# Altium schematic sheet Power.SchDoc
size A3; DocumentNumber: 3; SheetNumber: 3; SheetTotal: 18
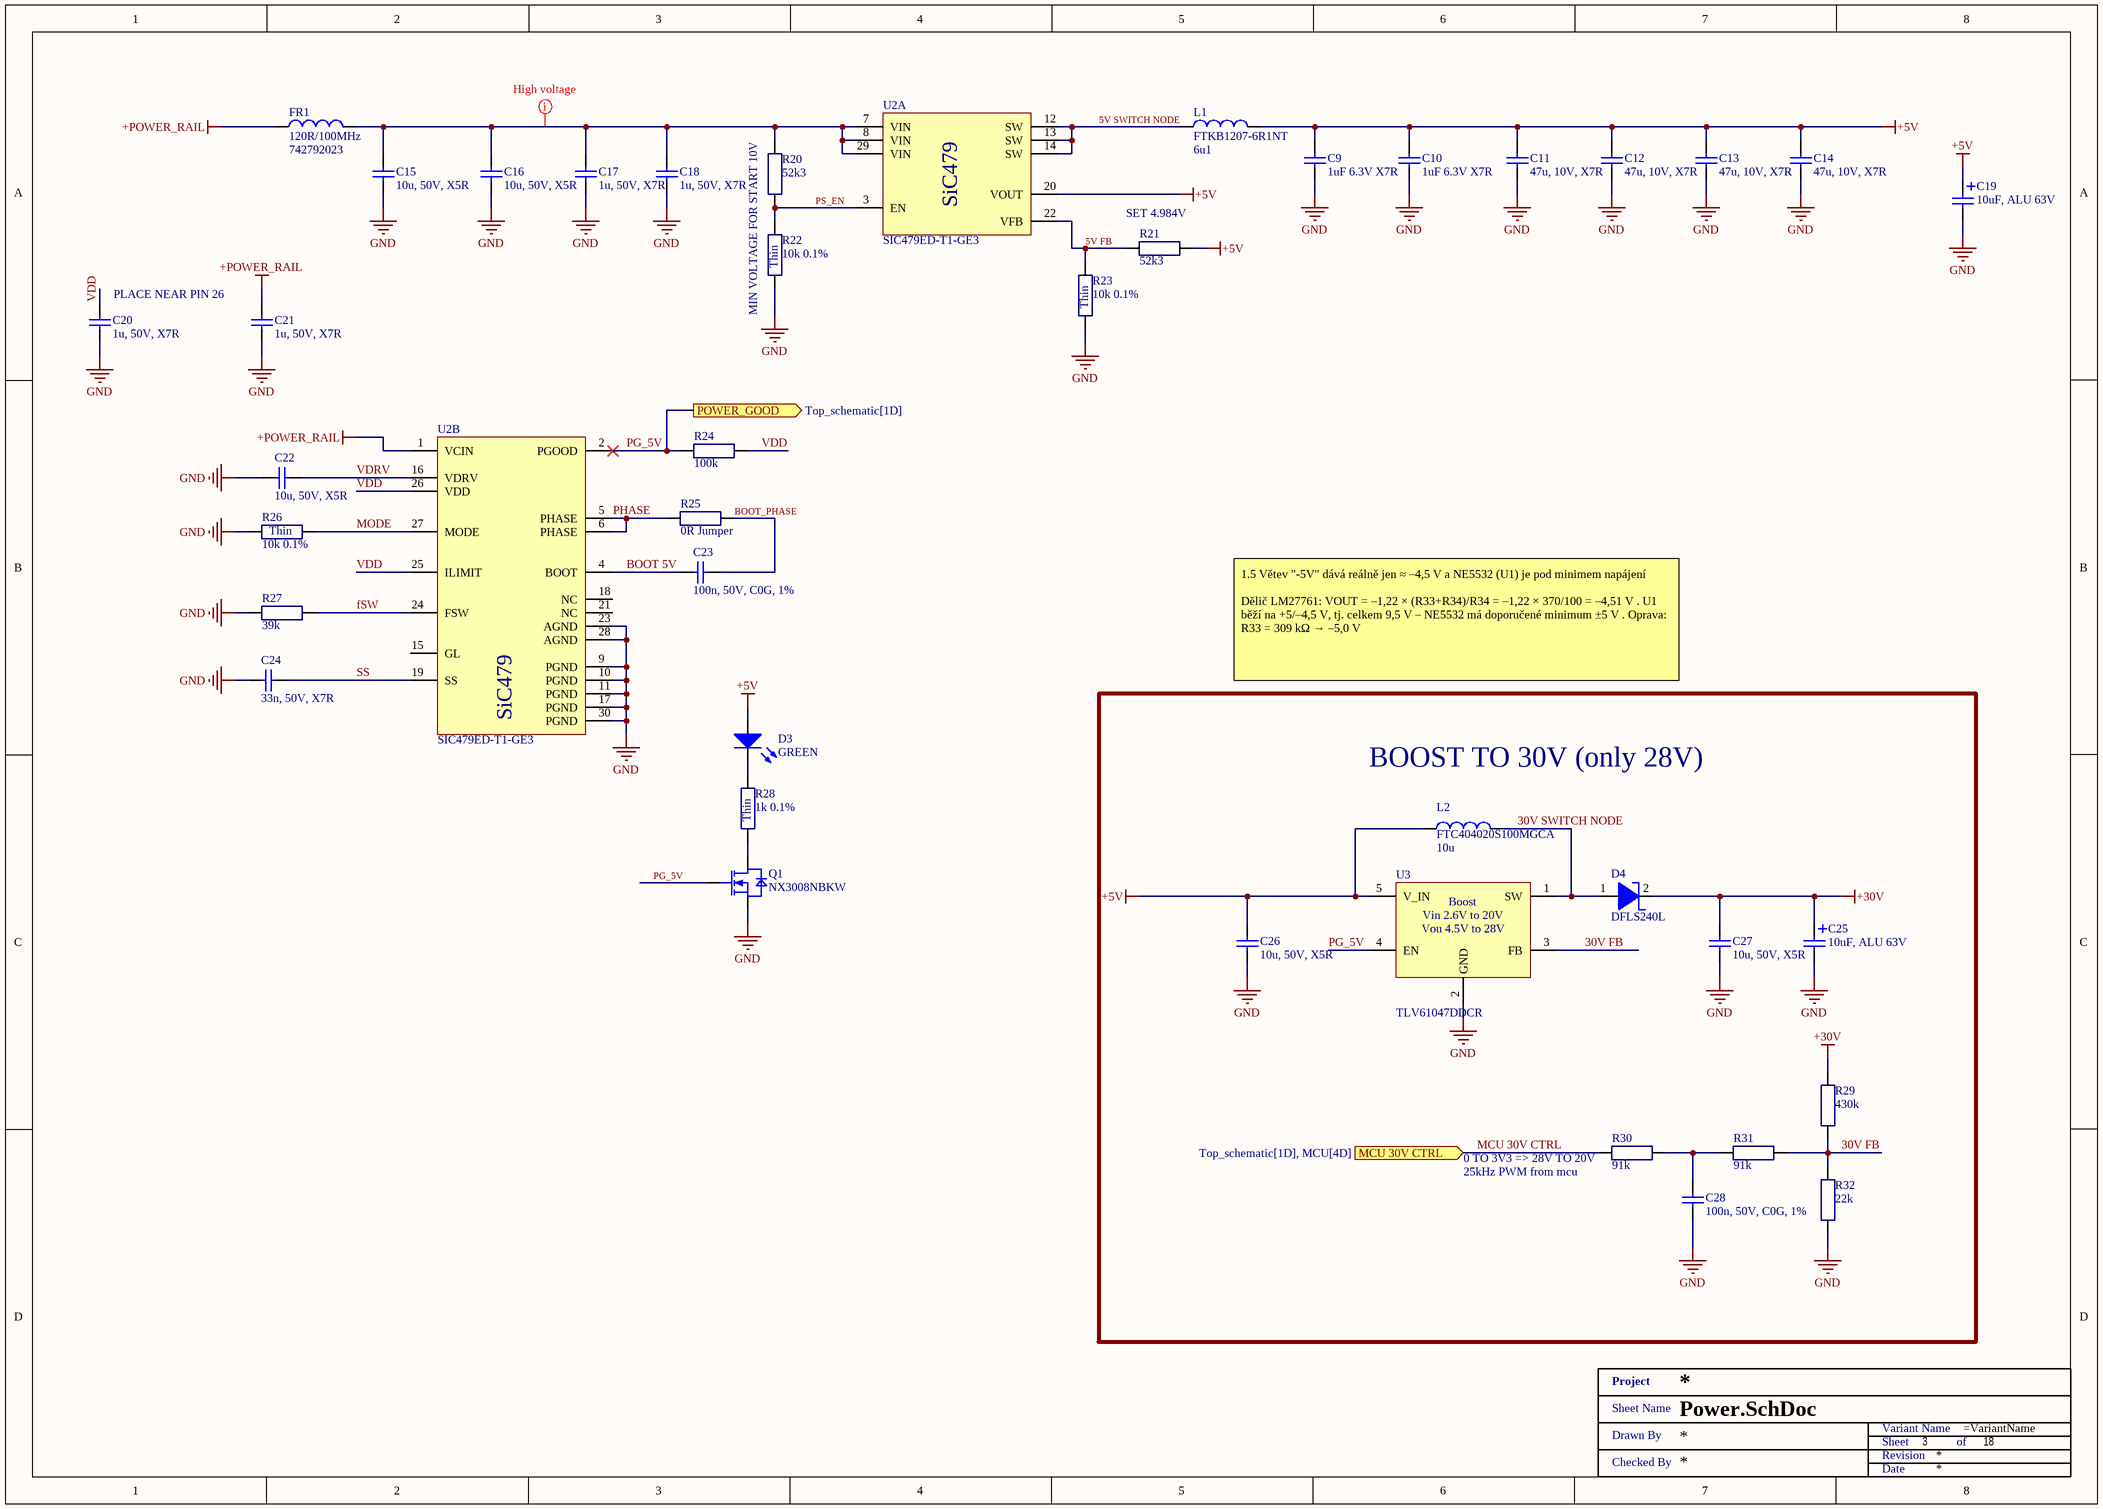
[diagram p0: Power.SchDoc]

## Parts
C9  1uF 6.3V X7R  [SMD0402]
C10  1uF 6.3V X7R  [SMD0402]
C11  47u, 10V, X7R  [SMD1210]
C12  47u, 10V, X7R  [SMD1210]
C13  47u, 10V, X7R  [SMD1210]
C14  47u, 10V, X7R  [SMD1210]
C15  10u, 50V, X5R  [SMD1206]
C16  10u, 50V, X5R  [SMD1206]
C17  1u, 50V, X7R  [SMD0603]
C18  1u, 50V, X7R  [SMD0603]
C19  10uF, ALU 63V  [WCAP-ATLI_5x11x2]
C20  1u, 50V, X7R  [SMD0603]
C21  1u, 50V, X7R  [SMD0603]
C22  10u, 50V, X5R  [SMD1206]
C23  100n, 50V, C0G, 1%  [SMD1206]
C24  33n, 50V, X7R  [SMD0603]
C25  10uF, ALU 63V  [WCAP-ATLI_5x11x2]
C26  10u, 50V, X5R  [SMD1206]
C27  10u, 50V, X5R  [SMD1206]
C28  100n, 50V, C0G, 1%  [SMD1206]
D3  GREEN  [MCL-S270]
D4  DFLS240L  [PowerDI 123]
FR1  120R/100MHz  [SMD0805 - R]
L1  FTKB1207-6R1NT  Inductance: 6u1  [FTKB1207]
L2  FTC404020S100MGCA  Inductance: 10u  [FTC404020S]
Q1  NX3008NBKW  [SOT323]
R20  52k3  [SMD0402 - R]
R21  52k3  [SMD0402 - R]
R22  10k 0.1%  [SMD0402 - R]
R23  10k 0.1%  [SMD0402 - R]
R24  100k  [SMD0402 - R]
R25  0R Jumper  [SMD0402 - R]
R26  10k 0.1%  [SMD0402 - R]
R27  39k  [SMD0402 - R]
R28  1k 0.1%  [SMD0402 - R]
R29  430k  [SMD0402 - R]
R30  91k  [SMD0402 - R]
R31  91k  [SMD0402 - R]
R32  22k  [SMD0402 - R]
U2  SIC479ED-T1-GE3  [POWERPAK_MLP55-27L_VIS]  (parts A,B of 2)
U3  TLV61047DDCR  [SOT23-5]
XX?  Title 1  (value not drawn)  (graphical)

## Blocks framed on the sheet
BOOST TO 30V (only 28V): C25-C28 D4 L2 R29-R32 U3

## Ports
MCU 30V CTRL (in, see Top_schematic[1D], MCU[4D]), POWER_GOOD (out, see Top_schematic[1D])

## Nets
+5V: C9.2 C10.2 C11.2 C12.2 C13.2 C14.2 C19.1 C26.2 D3.1(A) L1.2 L2.1 R21.2 U2.20(VOUT) U3.5(V_IN)
+30V: C25.1 C27.2 D4.2(C) R29.2
+POWER_RAIL: C21.2 FR1.1 U2.1(VCIN)
GND: C9.1 C10.1 C11.1 C12.1 C13.1 C14.1 C15.1 C16.1 C17.1 C18.1 C19.2 C20.1 C21.1 C22.2 C24.1 C25.2 C26.1 C27.1 C28.1 Q1.2(S) R22.1 R23.1 R26.1 R27.1 R32.1 U2.9(PGND) U2.10(PGND) U2.11(PGND) U2.17(PGND) U2.23(AGND) U2.28(AGND) U2.30(PGND) U3.2(GND)
5V FB: R21.1 R23.2 U2.22(VFB)
5V SWITCH NODE: L1.1 U2.12(SW) U2.13(SW) U2.14(SW)
30V FB: R29.1 R31.2 R32.2 U3.3(FB)
30V SWITCH NODE: D4.1(A) L2.2 U3.1(SW)
BOOT 5V: C23.1 U2.4(BOOT)
BOOT_PHASE: C23.2 R25.2
fSW: R27.2 U2.24(FSW)
MCU 30V CTRL: R30.1 ; port MCU 30V CTRL
MODE: R26.2 U2.27(MODE)
PG_5V: Q1.1(G) R24.1 U2.2(PGOOD) U3.4(EN) ; port POWER_GOOD
PHASE: R25.1 U2.5(PHASE) U2.6(PHASE)
PS_EN: R20.1 R22.2 U2.3(EN)
SS: C24.2 U2.19(SS)
VDD: C20.2 R24.2 U2.25(ILIMIT) U2.26(VDD)
VDRV: C22.1 U2.16(VDRV)
NetC15_2: C15.2 C16.2 C17.2 C18.2 FR1.2 R20.2 U2.7(VIN) U2.8(VIN) U2.29(VIN)
NetC28_2: C28.2 R30.2 R31.1
NetD3_2: D3.2(K) R28.2
NetQ1_3: Q1.3(D) R28.1

Not connected (* = marked no-connect by the designer): U2 15(GL) 18(NC) 21(NC)

## Layout directives
net class HV: NetC15_2

## Notes on the sheet
- (near R21) SET 4.984V
- (near C20) PLACE NEAR PIN 26
- MIN VOLTAGE FOR START 10V
- 1.5 Větev "-5V" dává reálně jen ≈ –4,5 V a NE5532 (U1) je pod minimem napájení
  Dělič LM27761: VOUT = –1,22 × (R33+R34)/R34 = –1,22 × 370/100 = –4,51 V . U1 běží na +5/–4,5 V, tj. celkem 9,5 V – NE5532 má doporučené minimum ±5 V . Oprava: R33 = 309 kΩ → –5,0 V
- (near R30) 0 TO 3V3 => 28V TO 20V
- (near R30) 25kHz PWM from mcu
- (in symbol SIC479ED-T1-GE3, part A) SiC479
- (in symbol SIC479ED-T1-GE3, part B) SiC479
- (in symbol TC0225B1001TCC) Thin
- (in symbol TC0225B1002TCC) Thin
- (in symbol Title 1) Project; Sheet Name; Variant Name; Drawn By; Sheet; of; Revision; Checked By; Date
- (in symbol TLV61047DDCR) Vin 2.6V to 20V; Vou 4.5V to 28V

## Library data of the parts
C9 C10 = TCC0402X7R105K6R3AT: Capacitor: MLCC; SMD; 0402; 1µF; 6.3V; ±10%; X7R; CCTC; Capacitance: 1u; Supplier 1: LCSC; Supplier Part Number 1: C5448871; Manufacturer: CCTC; Manufacturer Part Number: TCC0402X7R105K6R3AT; Category: Ceramic Capacitors; Stock 1: 242350; Pricing 1: 50=0.0089, 500=0.0072, 1500=0.0063, 10000=0.0058, 20000=0.0053, 50000=0.005 (USD); ComponentLink1URL: https://datasheet.octopart.com:443/TCC0402X7R105K6R3AT-CCTC-datasheet-194166649.pdf?src-supplier=LCSC; ComponentLink1Description: https://datasheet.octopart.com:443/TCC0402X7R105K6R3AT-CCTC-datasheet-194166649.pdf?src-supplier=LCSC; ComponentLink2URL: https://datasheet.octopart.com:443/TCC0402X7R105K6R3AT-CCTC-datasheet-192317456.pdf?src-supplier=HQonline; ComponentLink2Description: https://datasheet.octopart.com:443/TCC0402X7R105K6R3AT-CCTC-datasheet-192317456.pdf?src-supplier=HQonline
C11-C14 = CL32B476MPJNNNE: Cap Ceramic 47uF 10V X7R 20% Pad SMD 1210 125C T/R; Manufacturer: Samsung; Supplier 1: Mouser; Supplier Part Number 1: 187-CL32B476MPJNNNE; Manufacturer Part Number: CL32B476MPJNNNE; RoHS: Yes; Category: Ceramic Capacitors; Stock 1: 61232; Pricing 1: 1=0.51, 10=0.377, 50=0.377, 100=0.263, 1000=0.198, 10000=0.163 (USD); Case/Package: 1210; Dielectric: X7R; Voltage Rating (DC): 10V; Tolerance: 20%; Value: 47uF; RoHS Compliant: Yes; ComponentLink1URL: http://www.samsungsem.com/kr/support/library/product-catalog/__icsFiles/afieldfile/2014/11/13/MLCC.pdf?src-supplier=Avnet; ComponentLink1Description: http://www.samsungsem.com/kr/support/library/product-catalog/__icsFiles/afieldfile/2014/11/13/MLCC.pdf?src-supplier=Avnet; Supplier 2: Arrow Electronics; Supplier Part Number 2: CL32B476MPJNNNE
C15 C16 C22 C26 C27 = UMK316BBJ106KL-T: CAP CER 10UF 50V X5R 1206; Manufacturer: Taiyo Yuden; Tolerance: 10%; Supplier 1: Mouser; Supplier Part Number 1: 963-UMK316BBJ106KL-T; Manufacturer Part Number: UMK316BBJ106KL-T; RoHS: Yes; Category: Ceramic Capacitors; Stock 1: 207945; Pricing 1: 1=0,42000, 10=0,18000, 100=0,12800, 500=0,11000, 1000=0,09700, 2000=0,08000 (USD); Mount: Surface Mount; Case/Package: 1206; Min Operating Temperature: -55°C; Max Operating Temperature: 85°C; Packaging: Tape and Reel; Capacitance: 10u; Voltage Rating: 50V; Length: 0.126inch; Width: 0.063inch; Thickness: 0.071inch; Lead Free: Lead Free; ComponentLink1URL: http://ds.yuden.co.jp/TYCOMPAS/ut/detail.do?productNo=UMK316BBJ106KL-T&fileName=UMK316BBJ106KL-T_SS&mode=specSheetDownload&src-supplier=Digi-Key; ComponentLink1Description: http://ds.yuden.co.jp/TYCOMPAS/ut/detail.do?productNo=UMK316BBJ106KL-T&fileName=UMK316BBJ106KL-T_SS&mode=specSheetDownload&src-supplier=Digi-Key; ComponentLink2URL: https://www.yuden.co.jp/productdata/catalog/mlcc01_e.pdf?src-supplier=Digi-Key; ComponentLink2Description: https://www.yuden.co.jp/productdata/catalog/mlcc01_e.pdf?src-supplier=Digi-Key; ComponentLink3URL: http://www.yuden.co.jp/productdata/catalog/en/mlcc_all_e.pdf?src-supplier=Digi-Key; ComponentLink3Description: http://www.yuden.co.jp/productdata/catalog/en/mlcc_all_e.pdf?src-supplier=Digi-Key; Supplier 2: Digi-Key; Supplier Part Number 2: 587-5960-1-ND; Supplier 3: Avnet; Supplier Part Number 3: UMK316BBJ106KL-T
C17 C18 C20 C21 = UMK107AB7105KA-T: 0603 1 uF 50 V ±10% Tolerance X7R SMT Multilayer Ceramic Capacitor; Manufacturer: Taiyo Yuden; Supplier 1: Mouser; Supplier Part Number 1: 963-UMK107AB7105KA-T; Manufacturer Part Number: UMK107AB7105KA-T; RoHS: Yes; Category: Ceramic Capacitors; Stock 1: 419967; Pricing 1: 1=0,39000, 10=0,13500, 100=0,09200, 500=0,07800, 1000=0,06100, 4000=0,06100 (USD); Mount: Surface Mount; Case/Package: 0603; Case Code (Metric): 1608; Case Code (Imperial): 0603; Min Operating Temperature: -55°C; Max Operating Temperature: 125°C; Tolerance: 10%; Capacitance: 1u; Packaging: Tape and Reel; Package Quantity: 1; Voltage Rating: 50V; Voltage Rating (DC): 50V; Dielectric: X7R; Termination: SMD/SMT; Length: 1.6mm; Height: 0.8mm; Width: 0.031inch; Thickness: 0.037inch; Depth: 0.8mm; Radiation Hardening: No; Halogen Free: Halogen Free; ComponentLink1URL: https://datasheet.ciiva.com/15922/umk107ab7105ka-t-pdf-15922601.pdf?src-supplier=Onlinecomponents.com; ComponentLink1Description: https://datasheet.ciiva.com/15922/umk107ab7105ka-t-pdf-15922601.pdf?src-supplier=Onlinecomponents.com; ComponentLink2URL: https://datasheet.ciiva.com/6257/umk107ab7105ka-t-ss-6257600.pdf?src-supplier=Digi-Key; ComponentLink2Description: https://datasheet.ciiva.com/6257/umk107ab7105ka-t-ss-6257600.pdf?src-supplier=Digi-Key; ComponentLink3URL: https://datasheet.ciiva.com/30137/76umk107ab7105ka-t-30137806.pdf?src-supplier=Onlinecomponents.com; ComponentLink3Description: https://datasheet.ciiva.com/30137/76umk107ab7105ka-t-30137806.pdf?src-supplier=Onlinecomponents.com; Supplier 2: Farnell; Supplier Part Number 2: 2779113; Supplier 3: Digi-Key; Supplier Part Number 3: 587-3247-6-ND
C19 C25 = 860080772001: WURTH ELEKTRONIK - 860080772001 - CAP, ALU ELEC, 10UF, 63V, RADIAL; Ripple Current: 135mA @ 100kHz; Capacitance: 10u; Manufacturer: WURTH ELEKTRONIK; Manufacturer Part Number: 860080772001; RoHS: YES; Stock 1: 553; Pricing 1: 1=0.0957, 3=0.091, 5=0.0863, 10=0.0825, 20=0.0786, 50=0.0692, 250=0.0647, 500=0.0564 (GBP); ComponentLink1URL: http://www.farnell.com/datasheets/1879798.pdf; ComponentLink1Description: http://www.farnell.com/datasheets/1879798.pdf; Voltage Rating: 63V; Stock 3: 2136; Pricing 3: 1=0.62, 50=0.335, 100=0.289, 250=0.259, 500=0.235, 1500=0.202, 7500=0.182, 15000=0.178 (GBP); ComponentLink2URL: http://www.farnell.com/datasheets/2065186.pdf; ComponentLink2Description: http://www.farnell.com/datasheets/2065186.pdf; Supplier 1: Mouser; Supplier Part Number 1: 710-860080772001; Supplier 2: Farnell; Supplier Part Number 2: 2465955; Supplier 3: Digi-Key; Supplier Part Number 3: 732-9121-1-ND
C23 C28 = GCM31C5C1H104FA16L: CAP CER 0.1UF 50V C0G/NP0 1206 1%; Manufacturer: Murata; Supplier 1: Mouser; Supplier Part Number 1: 81-GCM31C5C1H104FA16; Manufacturer Part Number: GCM31C5C1H104FA16L; RoHS: No; Stock 1: 9381; Pricing 1: 1=1,24000, 10=0,98200, 25=0,90100, 100=0,73700, 250=0,59000, 500=0,55700 (USD); Supplier 2: Digi-Key; Supplier Part Number 2: 490-GCM31C5C1H104FA16LCT-ND; Supplier 3: Future Electronics; Supplier Part Number 3: GCM31C5C1H104FA16L-CUTT; Capacitance: 100n
C24 = 06035C333JAT2A: 0603 33nF Ceramic Multilayer Capacitor; 50 V dc; +125degC; X7R Dielectric; +/-5%; Manufacturer: Kyocera AVX; Tolerance: 5%; Dissipation Factor: 2.5%; Supplier 1: Mouser; Supplier Part Number 1: 581-06035C333J; Manufacturer Part Number: 06035C333JAT2A; Stock 1: 266948; Pricing 1: 1 = 0.13000, 10 = 0.12100, 50 = 0.12100, 100 = 0.06000, 1000 = 0.03600, 10000 = 0.02400 (USD); RoHS: Yes; Mount: Surface Mount,PCB; Case/Package: 0603; Number of Pins: 2; Case Code (Metric): 1608; Case Code (Imperial): 0603; Contact Plating: Tin,Matte; Dielectric Material: Ceramic; Min Operating Temperature: -55°C; Max Operating Temperature: 125°C; Capacitance: 33n; Dielectric: X7R; Packaging: Tape and Reel; Voltage Rating (DC): 50V; Package Quantity: 1; Voltage Rating: 50V; Termination: SMD/SMT; Voltage: 50V; Length: 1.6mm; Height: 0.9mm; Width: 0.032inch; Depth: 0.81mm; Thickness: 0.035inch; Radiation Hardening: No; REACH SVHC: No SVHC; Lead Free: Lead Free; ComponentLink1URL: https://datasheet.ciiva.com/7855/1679506-7855093.pdf?src-supplier=Element14; ComponentLink1Description: https://datasheet.ciiva.com/7855/1679506-7855093.pdf?src-supplier=Element14; ComponentLink2URL: https://datasheet.ciiva.com/28694/cx7r-28694479.pdf?src-supplier=Element14; ComponentLink2Description: https://datasheet.ciiva.com/28694/cx7r-28694479.pdf?src-supplier=Element14; ComponentLink3URL: https://datasheet.ciiva.com/152/cx7r-152032.pdf?src-supplier=Digi-Key; ComponentLink3Description: https://datasheet.ciiva.com/152/cx7r-152032.pdf?src-supplier=Digi-Key; ComponentLink4URL: https://datasheet.ciiva.com/152/cx7r-152033.pdf?src-supplier=Digi-Key; ComponentLink4Description: https://datasheet.ciiva.com/152/cx7r-152033.pdf?src-supplier=Digi-Key; ComponentLink5URL: https://datasheet.ciiva.com/1457/84526-1457941.pdf?src-supplier=Element14; ComponentLink5Description: https://datasheet.ciiva.com/1457/84526-1457941.pdf?src-supplier=Element14; ComponentLink6URL: https://datasheet.ciiva.com/1457/84526-1457942.pdf?src-supplier=Element14; ComponentLink6Description: https://datasheet.ciiva.com/1457/84526-1457942.pdf?src-supplier=Element14; ComponentLink7URL: https://datasheet.ciiva.com/17084/cx7r-17084518.pdf?src-supplier=Future+Electronics; ComponentLink7Description: https://datasheet.ciiva.com/17084/cx7r-17084518.pdf?src-supplier=Future+Electronics; ComponentLink8URL: https://datasheet.ciiva.com/2987/cx7r-2987848.pdf?src-supplier=Avnet; ComponentLink8Description: https://datasheet.ciiva.com/2987/cx7r-2987848.pdf?src-supplier=Avnet; ComponentLink9URL: https://datasheet.ciiva.com/14605/70001075-14605242.pdf?src-supplier=Allied+Electronics; ComponentLink9Description: https://datasheet.ciiva.com/14605/70001075-14605242.pdf?src-supplier=Allied+Electronics; ComponentLink10URL: https://datasheet.ciiva.com/152/cx7r-152031.pdf?src-supplier=Digi-Key; ComponentLink10Description: https://datasheet.ciiva.com/152/cx7r-152031.pdf?src-supplier=Digi-Key; Supplier 2: Farnell; Supplier Part Number 2: 2280893; Supplier 3: Digi-Key; Supplier Part Number 3: 478-3723-1-ND; Supplier 4: Arrow; Supplier Part Number 4: 06035C333JAT2A
D3 = MCL-S270GC: MULTICOMP - MCL-S270GC - LED, 0805, GREEN, 10MCD, 570NM; LED Mounting: SMD; Bulb Size: 1.25mm x 1.4; Forward Current If: 20; Forward Voltage: 2.1; Wavelength Typ: 570; Luminous Intensity: 10; Viewing Angle: 140°; Lens Shape: Rectangular; SVHC: No SVHC (17-Dec-2015); Forward Voltage VF Max: 2.6; LED / Lamp Size: 1.4mm x 1.25; LED Type: Standard; Luminous Intensity Max: 16; Luminous Intensity Min: 4.5; No. of Pins: 2; Peak Forward Current: 100; Peak Wavelength: 568; Reverse Protection Voltage: 5; Voltage Vf Min: 1.7; Voltage Vf Typ: 2.1V<!--FANDB--><div class="features-and-benefits-container"><div class="features-and-benefits-description"><span class="features-benefits-value">The MCL-S270GC is a green SMD LED made of GaP dice. This LED offers water clear rectangular lens and 260°C for 5 seconds lead soldering temperature range 1.6mm from body.</span></div><div class="features-and-benefits-list"><ul class="features-and-benefits-list-list"><li class="features-and-benefits-list-item">-40 to 85; Manufacturer: MULTICOMP; Manufacturer Part Number: MCL-S270GC; RoHS: YES; Stock 1: 80989; Pricing 1: 5=0,145, 25=0,136, 100=0,126, 250=0,0813, 500=0,0645, 2000=0,0559, 5000=0,0496, 20000=0,0434 (GBP); LED Colour: Green; Packaging: Cut Tape; Product Range: -; Automotive Qualification Standard: -; MSL: MSL 3 - 168 hours; Current Rating: 20; Dominant Wavelength: 570; Dominant Wavelength Typ: 570; Forward Current If Max: 20; Luminous Intensity Typ: 10; Operating Temperature Max: 85; Operating Temperature Min: -40; Operating Temperature Range: -40°C to +85; Storage Temperature Max: +100; Storage Temperature Min: -40; ComponentLink1URL: http://www.farnell.com/cad/53028.pdf; ComponentLink1Description: http://www.farnell.com/cad/53028.pdf; ComponentLink2URL: http://www.farnell.com/datasheets/1671537.pdf; ComponentLink2Description: http://www.farnell.com/datasheets/1671537.pdf; Supplier 1: Farnell; Supplier Part Number 1: 1581242; Supplier 2: Newark; Supplier Part Number 2: 14N9356
D4 = DFLS240L: 2.0A LOW VF SCHOTTKY BARRIER RECTIFIER; Manufacturer: Diodes Incorporated; Manufacturer Part Number: DFLS240L-7; Vrrm - Repetitive Reverse Voltage: 40 V; Vf - Forward Voltage: 0.65 V at 3 A; Ir - Reverse Current: 100 uA; Ifsm - Forward Surge Current: 50 A; If - Forward Current: 2 A; Pd - Power Dissipation: 1.67 W; Configuration: Single; Supplier 1: Farnell; Supplier Part Number 1: 1713897; Supplier 2: Mouser; Category: Schottky Diodes & Rectifiers; RoHS - Mouser: E; Minimum Order Quantity: 1; Standard Pack Qty: 3000; Product Category: Rectifier - Schottky; Technology: Si; Mounting Style: SMD/SMT; Series: DFLS240; Maximum Operating Temperature: + 125 C; Minimum Operating Temperature: - 55 C; Package / Case: POWERDI-123; Reeling: True; Product: Schottky Diodes; Packaging: Reel; RoHS: RoHS Compliant By Exemption; Brand: Diodes Incorporated; Supplier Part Number 2: 621-DFLS240L-7
FR1 = 742792023: WURTH ELEKTRONIK - 742792023 - FERRITE BEAD, 0.03OHM, 3A, 0805; Impedance @ 100MHz: 120; Ferrite Case Style: 0805 [2012 Metric]; DC Current Rating: 3; DC Resistance Max: 0.03; Impedance Tolerance: ± 25%; Ferrite Mounting: SMD; Resistance: 0.03ohm<!--FANDB--><div class="features-and-benefits-container"><div class="features-and-benefits-description"><span class="features-benefits-value">The 742792023 is a SMD EMI Suppression Ferrite Bead with 0805 case and reliable Ni-Sn electrodes. It can be put directly on the printed circuit board. It offers excellent anti-EMI properties and low DC resistance. Placed very close next to the interference source even with smallest size 0402, maximal impedance at 1000; Manufacturer: WURTH ELEKTRONIK; RoHS: YES; Stock 1: 4283; Pricing 1: 1=0,123, 50=0,112, 100=0,103, 500=0,0937, 1000=0,0877, 2000=0,0846 (GBP); Product Range: -; Automotive Qualification Standard: -; Packaging: Cut Tape; ComponentLink1URL: http://www.farnell.com/datasheets/1695980.pdf; ComponentLink1Description: http://www.farnell.com/datasheets/1695980.pdf; ComponentLink2URL: http://www.farnell.com/cad/1670054.zip; ComponentLink2Description: http://www.farnell.com/cad/1670054.zip; Supplier 1: Mouser; Supplier Part Number 1: 710-742792023; Supplier 2: Farnell; Supplier Part Number 2: 1635732; Supplier 3: Digi-Key; Supplier Part Number 3: 732-1613-1-ND; Manufacturer Part Number: 742792023
L1 = FTKB1207-6R1NT: FIXED IND 6.1uH 6.6A 0.018Ω SMD,12.5x12.5mm; Manufacturer: cjiang; Supplier 1: LCSC; Supplier Part Number 1: C3040409; Manufacturer Part Number: FTKB1207-6R1NT
L2 = FTC404020S100MGCA: FIXED IND 10uH 3.4A 135mΩ SMD,4.1x4.1mm; Manufacturer: Cjiang; Supplier 1: LCSC; Supplier Part Number 1: C39676074; Manufacturer Part Number: FTC404020S100MGCA; Category: Uncategorized; Stock 1: 10755; Pricing 1: 5=0.2573, 50=0.201, 150=0.1769, 500=0.1409, 3000=0.1275, 6000=0.1195 (USD)
Q1 = NX3008NBKW: NXP - NX3008NBKW - MOSFET, N CH, 30V, 350MA, SOT323; Transistor Polarity: N Channel; Continuous Drain Current Id: 350; Drain Source Voltage Vds: 30; On Resistance Rds(on): 1; Rds(on) Test Voltage Vgs: 4.5; Threshold Voltage Vgs: 900; Power Dissipation Pd: 260; Transistor Case Style: SOT-323; No. of Pins: 3; SVHC: No SVHC (17-Dec-2015); Pulse Current Idm: -0.8; Voltage Vgs th Max: 8; Manufacturer: NXP; Manufacturer Part Number: NX3008NBKW; RoHS: YES; Stock 1: 4764; Pricing 1: 1=0.0425, 25=0.0385, 100=0.0347, 250=0.0334, 500=0.0312, 2000=0.0291, 4000=0.0282, 20000=0.0273 (GBP); Operating Temperature Max: 150; Product Range: -; Automotive Qualification Standard: -; MSL: MSL 1 - Unlimited; Operating Temperature Min: -55; Operating Temperature Range: -55°C to +150; ComponentLink1URL: http://www.farnell.com/datasheets/1508392.pdf; ComponentLink1Description: http://www.farnell.com/datasheets/1508392.pdf; Supplier 1: Mouser; Supplier Part Number 1: 771-NX3008NBKW,115; Supplier 2: Farnell; Supplier Part Number 2: 2069546; Supplier 3: Arrow; Supplier Part Number 3: NX3008NBKW,115
R20 R21 = FRR0402F5232TS: 52.3kΩ 62.5mW 50V Thick Film Resistor ±1% ±100ppm/℃ 0402 Chip Resistor - Surface Mount RoHS; Manufacturer: FOJAN; Supplier 1: LCSC; Supplier Part Number 1: C55020765; Manufacturer Part Number: FRR0402F5232TS; Category: Uncategorized; Stock 1: 40300; Pricing 1: 100=0.0017, 1000=0.0016 (USD); Resistance: 52k3
R22 R23 R26 = TC0225B1002TCC: Fixed Resistor, Thin Film, 0.0625W, 10000ohm, 50V, 0.1% +/-Tol, Surface Mount, 0402; Manufacturer: Uniroyal; Power Rating: 62.5mW; Supplier 1: LCSC; Supplier Part Number 1: C2989267; Manufacturer Part Number: TC0225B1002TCC; Category: Chip SMD Resistors; Stock 1: 10200; Pricing 1: 20=0.0396, 200=0.0352, 600=0.0327, 2000=0.0312, 10000=0.0299, 20000=0.0292 (USD); Case/Package: 0402; Composition: Thin Film; Export Control Classification Number (ECCN) Code: EAR99; Height: 300µm; Harmonized Tariff Schedule (HTS) Code: 8533.21.00.30; Length: 1mm; Lifecycle Status: Production; Max Operating Temperature: 155°C; Min Operating Temperature: -55°C; Mounting Technology: Surface Mount; Number of Terminals: 2; Resistance: 10k; Tolerance: 0.1%; Width: 500µm; Working Voltage: 50V; ComponentLink1URL: https://datasheet.octopart.com:443/TC0225B1002TCC-Uniroyal-datasheet-194228365.pdf?src-supplier=LCSC; ComponentLink1Description: https://datasheet.octopart.com:443/TC0225B1002TCC-Uniroyal-datasheet-194228365.pdf?src-supplier=LCSC
R24 = RC0402FR-07100KL: 62.5mW Thick Film Resistors 50V ±100ppm/℃ ±1% 100kΩ 0402 Chip Resistor - Surface Mount ROHS; Manufacturer: Yageo Group; Max Power Dissipation: 63mW; Temperature Coefficient: 100ppm/°C; Supplier: Mouser; Supplier Part Number: 603-RC0402FR-07100KL; Manufacturer Part Number: RC0402FR-07100KL; RoHS: Compliant; Category: Chip SMD Resistors; Stock: 3390880; Pricing: 1=0,1, 10=0,011, 50=0,011, 100=0,007, 1000=0,006, 10000=0,002 (USD); Case/Package: 0402; Case Code (Imperial): 0402; Case Code (Metric): 0402; China RoHS: Non-Compliant; Composition: Thick Film; Contact Plating: Tin; Depth: 500µm; Features: Moisture Resistant; Height: 350µm; Lead Free: Lead Free; Length: 1mm; Lifecycle Status: Production; Max Operating Temperature: 155°C; Military Standard: Not; Min Operating Temperature: -55°C; Mounting Technology: Surface Mount; Pins: 2; Number of Terminals: 2; Number of Terminations: 2; Packaging: Cut Tape (CT); Power Rating: 62.5mW; Radiation Hardening: No; REACH SVHC: Yes; Resistance: 100k; Schedule B: 8533210045, 8533210045|8533210045, 8533210045|8533210045|8533210045, 8533210045|8533210045|8533210045|8533210045; Termination: SMD/SMT; Tolerance: 1%; Voltage Rating: 50V; Voltage Rating (AC): 50V; Voltage Rating (DC): 50V; Width: 500µm; Working Voltage: 50V; ComponentLink1URL: https://datasheet.octopart.com:443/RC0402FR-07100KL-Yageo-datasheet-175887523.pdf?src-supplier=Newark; ComponentLink1Description: https://datasheet.octopart.com:443/RC0402FR-07100KL-Yageo-datasheet-175887523.pdf?src-supplier=Newark; ComponentLink2URL: https://datasheet.octopart.com:443/RC0402FR-07100KL-Yageo-datasheet-10408619.pdf?src-supplier=Newark; ComponentLink2Description: https://datasheet.octopart.com:443/RC0402FR-07100KL-Yageo-datasheet-10408619.pdf?src-supplier=Newark; ComponentLink3URL: https://datasheet.octopart.com:443/RC0402FR-07100KL-Yageo-datasheet-8324527.pdf?src-supplier=Newark; ComponentLink3Description: https://datasheet.octopart.com:443/RC0402FR-07100KL-Yageo-datasheet-8324527.pdf?src-supplier=Newark; ComponentLink4URL: https://datasheet.octopart.com:443/RC0402FR-07100KL-Yageo-datasheet-103092701.pdf?src-supplier=Upverter; ComponentLink4Description: https://datasheet.octopart.com:443/RC0402FR-07100KL-Yageo-datasheet-103092701.pdf?src-supplier=Upverter; ComponentLink5URL: https://datasheet.octopart.com:443/RC0402FR-07100KL-Yageo-datasheet-141435361.pdf?src-supplier=Upverter; ComponentLink5Description: https://datasheet.octopart.com:443/RC0402FR-07100KL-Yageo-datasheet-141435361.pdf?src-supplier=Upverter; ComponentLink6URL: https://datasheet.octopart.com:443/RC0402FR-07100KL-Yageo-datasheet-62067350.pdf?src-supplier=Farnell; ComponentLink6Description: https://datasheet.octopart.com:443/RC0402FR-07100KL-Yageo-datasheet-62067350.pdf?src-supplier=Farnell; ComponentLink7URL: https://datasheet.octopart.com:443/RC0402FR-07100KL-Yageo-datasheet-12531192.pdf?src-supplier=Future+Electronics; ComponentLink7Description: https://datasheet.octopart.com:443/RC0402FR-07100KL-Yageo-datasheet-12531192.pdf?src-supplier=Future+Electronics; ComponentLink8URL: https://datasheet.octopart.com:443/RC0402FR-07100KL-Yageo-Group-datasheet-176638170.pdf?src-supplier=Future+Electronics; ComponentLink8Description: https://datasheet.octopart.com:443/RC0402FR-07100KL-Yageo-Group-datasheet-176638170.pdf?src-supplier=Future+Electronics; ComponentLink9URL: https://datasheet.octopart.com:443/RC0402FR-07100KL-Yageo-datasheet-164759695.pdf?src-supplier=Future+Electronics; ComponentLink9Description: https://datasheet.octopart.com:443/RC0402FR-07100KL-Yageo-datasheet-164759695.pdf?src-supplier=Future+Electronics; ComponentLink10URL: https://datasheet.octopart.com:443/RC0402FR-07100KL-Yageo-datasheet-127823281.pdf?src-supplier=Future+Electronics; ComponentLink10Description: https://datasheet.octopart.com:443/RC0402FR-07100KL-Yageo-datasheet-127823281.pdf?src-supplier=Future+Electronics; ComponentLink11URL: https://datasheet.octopart.com:443/RC0402FR-07100KL-Yageo-datasheet-137700087.pdf?src-supplier=Future+Electronics; ComponentLink11Description: https://datasheet.octopart.com:443/RC0402FR-07100KL-Yageo-datasheet-137700087.pdf?src-supplier=Future+Electronics; ComponentLink12URL: https://datasheet.octopart.com:443/RC0402FR-07100KL-Yageo-datasheet-98239111.pdf?src-supplier=Future+Electronics; ComponentLink12Description: https://datasheet.octopart.com:443/RC0402FR-07100KL-Yageo-datasheet-98239111.pdf?src-supplier=Future+Electronics; ComponentLink13URL: https://datasheet.octopart.com:443/RC0402FR-07100KL-Yageo-datasheet-77992522.pdf?src-supplier=Future+Electronics; ComponentLink13Description: https://datasheet.octopart.com:443/RC0402FR-07100KL-Yageo-datasheet-77992522.pdf?src-supplier=Future+Electronics; ComponentLink14URL: https://datasheet.octopart.com:443/RC0402FR-07100KL-Yageo-datasheet-67302840.pdf?src-supplier=Future+Electronics; ComponentLink14Description: https://datasheet.octopart.com:443/RC0402FR-07100KL-Yageo-datasheet-67302840.pdf?src-supplier=Future+Electronics; ComponentLink15URL: https://datasheet.octopart.com:443/RC0402FR-07100KL-Yageo-datasheet-8324255.pdf?src-supplier=Future+Electronics; ComponentLink15Description: https://datasheet.octopart.com:443/RC0402FR-07100KL-Yageo-datasheet-8324255.pdf?src-supplier=Future+Electronics; ComponentLink16URL: https://datasheet.octopart.com:443/RC0402FR-07100KL-Yageo-datasheet-8329306.pdf?src-supplier=element14; ComponentLink16Description: https://datasheet.octopart.com:443/RC0402FR-07100KL-Yageo-datasheet-8329306.pdf?src-supplier=element14; ComponentLink17URL: https://datasheet.octopart.com:443/RC0402FR-07100KL-Yageo-datasheet-175423674.pdf?src-supplier=SOS+electronic; ComponentLink17Description: https://datasheet.octopart.com:443/RC0402FR-07100KL-Yageo-datasheet-175423674.pdf?src-supplier=SOS+electronic; ComponentLink18URL: https://datasheet.octopart.com:443/RC0402FR-07100KL-Yageo-datasheet-148775077.pdf?src-supplier=TME; ComponentLink18Description: https://datasheet.octopart.com:443/RC0402FR-07100KL-Yageo-datasheet-148775077.pdf?src-supplier=TME; ComponentLink19URL: https://datasheet.octopart.com:443/RC0402FR-07100KL-Yageo-datasheet-79472498.pdf?src-supplier=Megastar; ComponentLink19Description: https://datasheet.octopart.com:443/RC0402FR-07100KL-Yageo-datasheet-79472498.pdf?src-supplier=Megastar; ComponentLink20URL: https://datasheet.octopart.com/RC0402FR-07100KL-Yageo-datasheet-73766026.pdf; ComponentLink20Description: https://datasheet.octopart.com/RC0402FR-07100KL-Yageo-datasheet-73766026.pdf; ComponentLink21URL: http://sigma.octopart.com:80/conflict_mineral_statement/Yageo-company-3.pdf?src-supplier=Compliance+Statements; ComponentLink21Description: http://sigma.octopart.com:80/conflict_mineral_statement/Yageo-company-3.pdf?src-supplier=Compliance+Statements; ComponentLink22URL: http://sigma.octopart.com:80/rohs_statement/Yageo-company-2.pdf?src-supplier=Compliance+Statements; ComponentLink22Description: http://sigma.octopart.com:80/rohs_statement/Yageo-company-2.pdf?src-supplier=Compliance+Statements
R25 = HQ02WAF0000TCE: Resistor: thick film / jumper; SMD; 0402; 0Ω; 100mW; max 50V; -55÷155°C; UNI-ROYAL; Manufacturer: Uniroyal; Supplier 1: LCSC; Supplier Part Number 1: C2791314; Manufacturer Part Number: HQ02WAF0000TCE; Category: Uncategorized; Stock 1: 5900; Pricing 1: 100=0.0059, 1000=0.0051, 3000=0.0047, 10000=0.0045, 50000=0.0043 (USD); ComponentLink1URL: https://datasheet.octopart.com:443/HQ02WAF0000TCE-Uniroyal-datasheet-194224146.pdf?src-supplier=LCSC; ComponentLink1Description: https://datasheet.octopart.com:443/HQ02WAF0000TCE-Uniroyal-datasheet-194224146.pdf?src-supplier=LCSC; Resistance: 0R
R27 = RC0402FR-0739KL: Res Thick Film 0402 39K Ohm 1% 0.063W(1/16W) ±100ppm/C Pad SMD T/R; Manufacturer: Yageo Group; Max Power Dissipation: 63mW; Power Rating: 62.5mW; Temperature Coefficient: 100ppm/°C; Voltage Rating: 50V; Supplier 1: Mouser; Supplier Part Number 1: 603-RC0402FR-0739KL; Manufacturer Part Number: RC0402FR-0739KL; RoHS: Compliant; Category: Chip SMD Resistors; Stock 1: 313189; Pricing 1: 1=0.1, 10=0.011, 50=0.011, 100=0.006, 1000=0.006, 10000=0.002 (USD); Case/Package: 0402; Case Code (Imperial): 0402; China RoHS: Non-Compliant; Composition: Thick Film; Depth: 500µm; Features: Moisture Resistant; Height: 350µm; Lead Free: Lead Free; Length: 1mm; Lifecycle Status: Production; Max Operating Temperature: 155°C; Military Standard: Not; Min Operating Temperature: -55°C; Mounting Technology: Surface Mount; Pins: 2; Number of Terminals: 2; Number of Terminations: 2; REACH SVHC: Yes; Resistance: 39k; Schedule B: 8533210045, 8533210045|8533210045, 8533210045|8533210045|8533210045, 8533210045|8533210045|8533210045|8533210045; Termination: SMD/SMT; Tolerance: 1%; Voltage Rating (AC): 50V; Voltage Rating (DC): 50V; Width: 500µm; Working Voltage: 50V; ComponentLink1URL: https://datasheet.octopart.com:443/RC0402FR-0739KL-Yageo-datasheet-175887523.pdf?src-supplier=IHS; ComponentLink1Description: https://datasheet.octopart.com:443/RC0402FR-0739KL-Yageo-datasheet-175887523.pdf?src-supplier=IHS; ComponentLink2URL: https://datasheet.octopart.com:443/RC0402FR-0739KL-Yageo-datasheet-103092701.pdf?src-supplier=Upverter; ComponentLink2Description: https://datasheet.octopart.com:443/RC0402FR-0739KL-Yageo-datasheet-103092701.pdf?src-supplier=Upverter; ComponentLink3URL: https://datasheet.octopart.com:443/RC0402FR-0739KL-Yageo-Group-datasheet-190305687.pdf?src-supplier=Newark; ComponentLink3Description: https://datasheet.octopart.com:443/RC0402FR-0739KL-Yageo-Group-datasheet-190305687.pdf?src-supplier=Newark; ComponentLink4URL: https://datasheet.octopart.com:443/RC0402FR-0739KL-Yageo-datasheet-8324527.pdf?src-supplier=Newark; ComponentLink4Description: https://datasheet.octopart.com:443/RC0402FR-0739KL-Yageo-datasheet-8324527.pdf?src-supplier=Newark; ComponentLink5URL: https://datasheet.octopart.com:443/RC0402FR-0739KL-Yageo-datasheet-10408619.pdf?src-supplier=element14+APAC; ComponentLink5Description: https://datasheet.octopart.com:443/RC0402FR-0739KL-Yageo-datasheet-10408619.pdf?src-supplier=element14+APAC; ComponentLink6URL: https://datasheet.octopart.com:443/RC0402FR-0739KL-Yageo-datasheet-62067350.pdf?src-supplier=element14+APAC; ComponentLink6Description: https://datasheet.octopart.com:443/RC0402FR-0739KL-Yageo-datasheet-62067350.pdf?src-supplier=element14+APAC; ComponentLink7URL: https://datasheet.octopart.com:443/RC0402FR-0739KL-Yageo-datasheet-176638170.pdf?src-supplier=Future+Electronics; ComponentLink7Description: https://datasheet.octopart.com:443/RC0402FR-0739KL-Yageo-datasheet-176638170.pdf?src-supplier=Future+Electronics; ComponentLink8URL: https://datasheet.octopart.com:443/RC0402FR-0739KL-Yageo-datasheet-164759695.pdf?src-supplier=Future+Electronics; ComponentLink8Description: https://datasheet.octopart.com:443/RC0402FR-0739KL-Yageo-datasheet-164759695.pdf?src-supplier=Future+Electronics; ComponentLink9URL: https://datasheet.octopart.com:443/RC0402FR-0739KL-Yageo-datasheet-137700087.pdf?src-supplier=Future+Electronics; ComponentLink9Description: https://datasheet.octopart.com:443/RC0402FR-0739KL-Yageo-datasheet-137700087.pdf?src-supplier=Future+Electronics; ComponentLink10URL: https://datasheet.octopart.com:443/RC0402FR-0739KL-Yageo-datasheet-12531192.pdf?src-supplier=Future+Electronics; ComponentLink10Description: https://datasheet.octopart.com:443/RC0402FR-0739KL-Yageo-datasheet-12531192.pdf?src-supplier=Future+Electronics; ComponentLink11URL: https://datasheet.octopart.com:443/RC0402FR-0739KL-Yageo-datasheet-148775077.pdf?src-supplier=TME; ComponentLink11Description: https://datasheet.octopart.com:443/RC0402FR-0739KL-Yageo-datasheet-148775077.pdf?src-supplier=TME; ComponentLink12URL: https://datasheet.octopart.com:443/RC0402FR-0739KL-Yageo-datasheet-79472498.pdf?src-supplier=Megastar; ComponentLink12Description: https://datasheet.octopart.com:443/RC0402FR-0739KL-Yageo-datasheet-79472498.pdf?src-supplier=Megastar; ComponentLink13URL: https://datasheet.octopart.com/RC0402FR-0739KL-Yageo-datasheet-73766026.pdf; ComponentLink13Description: https://datasheet.octopart.com/RC0402FR-0739KL-Yageo-datasheet-73766026.pdf; ComponentLink14URL: https://datasheet.octopart.com:443/RC0402FR-0739KL-Yageo-datasheet-8329306.pdf?src-supplier=element14; ComponentLink14Description: https://datasheet.octopart.com:443/RC0402FR-0739KL-Yageo-datasheet-8329306.pdf?src-supplier=element14; ComponentLink15URL: http://sigma.octopart.com:80/conflict_mineral_statement/Yageo-company-3.pdf?src-supplier=Compliance+Statements; ComponentLink15Description: http://sigma.octopart.com:80/conflict_mineral_statement/Yageo-company-3.pdf?src-supplier=Compliance+Statements; ComponentLink16URL: http://sigma.octopart.com:80/rohs_statement/Yageo-company-2.pdf?src-supplier=Compliance+Statements; ComponentLink16Description: http://sigma.octopart.com:80/rohs_statement/Yageo-company-2.pdf?src-supplier=Compliance+Statements; Supplier Part Number 2: C137995; Supplier 2: LCSC
R28 = TC0225B1001TCC: 62.5mW Thin Film Resistor 25V ±25ppm/℃ ±0.1% 1kΩ 0402 Chip Resistor - Surface Mount ROHS; Manufacturer: Uniroyal; Working Voltage: 50V; Supplier 1: LCSC; Supplier Part Number 1: C2989674; Manufacturer Part Number: TC0225B1001TCC; Category: Chip SMD Resistors; Stock 1: 12060; Pricing 1: 20=0.036, 200=0.031, 600=0.0283, 2000=0.0267, 10000=0.0252, 20000=0.0245 (USD); Case/Package: 0402; Composition: Thin Film; Export Control Classification Number (ECCN) Code: EAR99; Height: 300µm; Harmonized Tariff Schedule (HTS) Code: 8533.21.00.30; Length: 1mm; Lifecycle Status: Production; Max Operating Temperature: 155°C; Min Operating Temperature: -55°C; Mounting Technology: Surface Mount; Number of Terminals: 2; Power Rating: 62.5mW; Resistance: 1k; Tolerance: 0.1%; Width: 500µm; ComponentLink1URL: https://datasheet.octopart.com:443/TC0225B1001TCC-Uniroyal-datasheet-194228365.pdf?src-supplier=LCSC; ComponentLink1Description: https://datasheet.octopart.com:443/TC0225B1001TCC-Uniroyal-datasheet-194228365.pdf?src-supplier=LCSC
R29 = RC0402FR-07430KL: 62.5mW Thick Film Resistors 50V ±100ppm/℃ ±1% 430kΩ 0402 Chip Resistor - Surface Mount ROHS; Manufacturer: Yageo Group; Max Power Dissipation: 63mW; Temperature Coefficient: 100ppm/°C; Supplier 1: Mouser; Supplier Part Number 1: 603-RC0402FR-07430KL; Manufacturer Part Number: RC0402FR-07430KL; RoHS: Compliant; Category: Chip SMD Resistors; Stock 1: 32357; Pricing 1: 1=0.1, 10=0.009, 50=0.009, 100=0.006, 1000=0.006, 10000=0.002 (USD); Case/Package: 0402; Case Code (Imperial): 0402; China RoHS: Non-Compliant; Composition: Thick Film; Contact Plating: Tin; Country of Origin: Mainland China, Taiwan; Depth: 500µm; Export Control Classification Number (ECCN) Code: EAR99; Features: Moisture Resistant; Height: 350µm; Harmonized Tariff Schedule (HTS) Code: 8533.21.00.30; Introduction Date: 2008-07-18; Lead Free: Lead Free; Length: 1mm; Lifecycle Status: Production; Max Operating Temperature: 155°C; Military Standard: Not; Min Operating Temperature: -55°C; Mounting Technology: Surface Mount; Pins: 2; Number of Terminals: 2; Number of Terminations: 2; Packaging: Cut Tape; Power Rating: 62.5mW; REACH SVHC: Yes; Resistance: 430k; Schedule B: 8533210045, 8533210045|8533210045, 8533210045|8533210045|8533210045, 8533210045|8533210045|8533210045|8533210045; Termination: SMD/SMT; Tolerance: 1%; Voltage Rating: 50V; Voltage Rating (DC): 50V; Width: 500µm; Working Voltage: 50V; ComponentLink1URL: https://datasheet.octopart.com:443/RC0402FR-07430KL-Yageo-datasheet-175887523.pdf?src-supplier=Newark; ComponentLink1Description: https://datasheet.octopart.com:443/RC0402FR-07430KL-Yageo-datasheet-175887523.pdf?src-supplier=Newark; ComponentLink2URL: https://datasheet.octopart.com:443/RC0402FR-07430KL-Yageo-datasheet-103092701.pdf?src-supplier=Upverter; ComponentLink2Description: https://datasheet.octopart.com:443/RC0402FR-07430KL-Yageo-datasheet-103092701.pdf?src-supplier=Upverter; ComponentLink3URL: https://datasheet.octopart.com:443/RC0402FR-07430KL-Yageo-Group-datasheet-190305687.pdf?src-supplier=Future+Electronics; ComponentLink3Description: https://datasheet.octopart.com:443/RC0402FR-07430KL-Yageo-Group-datasheet-190305687.pdf?src-supplier=Future+Electronics; ComponentLink4URL: https://datasheet.octopart.com:443/RC0402FR-07430KL-Yageo-datasheet-164759695.pdf?src-supplier=Future+Electronics; ComponentLink4Description: https://datasheet.octopart.com:443/RC0402FR-07430KL-Yageo-datasheet-164759695.pdf?src-supplier=Future+Electronics; ComponentLink5URL: https://datasheet.octopart.com:443/RC0402FR-07430KL-Yageo-datasheet-137700087.pdf?src-supplier=Future+Electronics; ComponentLink5Description: https://datasheet.octopart.com:443/RC0402FR-07430KL-Yageo-datasheet-137700087.pdf?src-supplier=Future+Electronics; ComponentLink6URL: https://datasheet.octopart.com:443/RC0402FR-07430KL-Yageo-datasheet-12531192.pdf?src-supplier=Future+Electronics; ComponentLink6Description: https://datasheet.octopart.com:443/RC0402FR-07430KL-Yageo-datasheet-12531192.pdf?src-supplier=Future+Electronics; ComponentLink7URL: https://datasheet.octopart.com:443/RC0402FR-07430KL-Yageo-datasheet-10408619.pdf?src-supplier=element14+APAC; ComponentLink7Description: https://datasheet.octopart.com:443/RC0402FR-07430KL-Yageo-datasheet-10408619.pdf?src-supplier=element14+APAC; ComponentLink8URL: https://datasheet.octopart.com:443/RC0402FR-07430KL-Yageo-Group-datasheet-189192902.pdf?src-supplier=LCSC; ComponentLink8Description: https://datasheet.octopart.com:443/RC0402FR-07430KL-Yageo-Group-datasheet-189192902.pdf?src-supplier=LCSC; ComponentLink9URL: https://datasheet.octopart.com:443/RC0402FR-07430KL-Yageo-Group-datasheet-176638170.pdf?src-supplier=TME; ComponentLink9Description: https://datasheet.octopart.com:443/RC0402FR-07430KL-Yageo-Group-datasheet-176638170.pdf?src-supplier=TME; ComponentLink10URL: https://datasheet.octopart.com/RC0402FR-07430KL-Yageo-datasheet-73766026.pdf; ComponentLink10Description: https://datasheet.octopart.com/RC0402FR-07430KL-Yageo-datasheet-73766026.pdf; ComponentLink11URL: https://datasheet.octopart.com:443/RC0402FR-07430KL-Yageo-datasheet-8324527.pdf?src-supplier=Farnell; ComponentLink11Description: https://datasheet.octopart.com:443/RC0402FR-07430KL-Yageo-datasheet-8324527.pdf?src-supplier=Farnell; ComponentLink12URL: http://sigma.octopart.com:80/conflict_mineral_statement/Yageo-company-3.pdf?src-supplier=Compliance+Statements; ComponentLink12Description: http://sigma.octopart.com:80/conflict_mineral_statement/Yageo-company-3.pdf?src-supplier=Compliance+Statements; ComponentLink13URL: http://sigma.octopart.com:80/rohs_statement/Yageo-company-2.pdf?src-supplier=Compliance+Statements; ComponentLink13Description: http://sigma.octopart.com:80/rohs_statement/Yageo-company-2.pdf?src-supplier=Compliance+Statements; Supplier Part Number 2: C163463; Supplier 2: LCSC
R30 R31 = HP02WAF9102TCE: RES 91kΩ ±1% 100mW 0402; Manufacturer: Uniroyal; Manufacturer Part Number: HP02WAF9102TCE; Supplier 1: LCSC; Supplier Part Number 1: C2759470; Resistance: 91k
R32 = RC0402FR-0722KL: Res Thick Film 0402 22K Ohm 1% 0.063W(1/16W) ±100ppm/C Pad SMD T/R; Manufacturer: Yageo Group; Max Power Dissipation: 63mW; Power Rating: 62.5mW; Temperature Coefficient: 100ppm/°C; Voltage Rating: 50V; Supplier 1: Mouser; Supplier Part Number 1: 603-RC0402FR-0722KL; Manufacturer Part Number: RC0402FR-0722KL; RoHS: Compliant; Category: Chip SMD Resistors; Stock 1: 473074; Pricing 1: 1=0.1, 10=0.009, 50=0.009, 100=0.007, 1000=0.006, 10000=0.002 (USD); Case/Package: 0402; Case Code (Imperial): 0402; China RoHS: Non-Compliant; Composition: Thick Film; Depth: 500µm; Features: Moisture Resistant; Height: 350µm; Lead Free: Lead Free; Length: 1mm; Lifecycle Status: Production; Max Operating Temperature: 155°C; Military Standard: Not; Min Operating Temperature: -55°C; Mounting Technology: Surface Mount; Pins: 2; Number of Terminals: 2; Number of Terminations: 2; Packaging: Tape & Reel; REACH SVHC: Yes; Resistance: 22k; Schedule B: 8533210045, 8533210045|8533210045, 8533210045|8533210045|8533210045, 8533210045|8533210045|8533210045|8533210045; Termination: SMD/SMT; Tolerance: 1%; Voltage Rating (AC): 50V; Voltage Rating (DC): 50V; Width: 500µm; Working Voltage: 50V; ComponentLink1URL: https://datasheet.octopart.com:443/RC0402FR-0722KL-Yageo-datasheet-175887523.pdf?src-supplier=IHS; ComponentLink1Description: https://datasheet.octopart.com:443/RC0402FR-0722KL-Yageo-datasheet-175887523.pdf?src-supplier=IHS; ComponentLink2URL: https://datasheet.octopart.com:443/RC0402FR-0722KL-Yageo-datasheet-10408619.pdf?src-supplier=element14+APAC; ComponentLink2Description: https://datasheet.octopart.com:443/RC0402FR-0722KL-Yageo-datasheet-10408619.pdf?src-supplier=element14+APAC; ComponentLink3URL: https://datasheet.octopart.com:443/RC0402FR-0722KL-Yageo-datasheet-62067350.pdf?src-supplier=element14+APAC; ComponentLink3Description: https://datasheet.octopart.com:443/RC0402FR-0722KL-Yageo-datasheet-62067350.pdf?src-supplier=element14+APAC; ComponentLink4URL: https://datasheet.octopart.com:443/RC0402FR-0722KL-Yageo-datasheet-103092701.pdf?src-supplier=Upverter; ComponentLink4Description: https://datasheet.octopart.com:443/RC0402FR-0722KL-Yageo-datasheet-103092701.pdf?src-supplier=Upverter; ComponentLink5URL: https://datasheet.octopart.com:443/RC0402FR-0722KL-Yageo-Group-datasheet-190305687.pdf?src-supplier=Future+Electronics; ComponentLink5Description: https://datasheet.octopart.com:443/RC0402FR-0722KL-Yageo-Group-datasheet-190305687.pdf?src-supplier=Future+Electronics; ComponentLink6URL: https://datasheet.octopart.com:443/RC0402FR-0722KL-Yageo-datasheet-164759695.pdf?src-supplier=Future+Electronics; ComponentLink6Description: https://datasheet.octopart.com:443/RC0402FR-0722KL-Yageo-datasheet-164759695.pdf?src-supplier=Future+Electronics; ComponentLink7URL: https://datasheet.octopart.com:443/RC0402FR-0722KL-Yageo-datasheet-137700087.pdf?src-supplier=Future+Electronics; ComponentLink7Description: https://datasheet.octopart.com:443/RC0402FR-0722KL-Yageo-datasheet-137700087.pdf?src-supplier=Future+Electronics; ComponentLink8URL: https://datasheet.octopart.com:443/RC0402FR-0722KL-Yageo-datasheet-12531192.pdf?src-supplier=Future+Electronics; ComponentLink8Description: https://datasheet.octopart.com:443/RC0402FR-0722KL-Yageo-datasheet-12531192.pdf?src-supplier=Future+Electronics; ComponentLink9URL: https://datasheet.octopart.com:443/RC0402FR-0722KL-Yageo-datasheet-8324255.pdf?src-supplier=Future+Electronics; ComponentLink9Description: https://datasheet.octopart.com:443/RC0402FR-0722KL-Yageo-datasheet-8324255.pdf?src-supplier=Future+Electronics; ComponentLink10URL: https://datasheet.octopart.com:443/RC0402FR-0722KL-Yageo-datasheet-8329306.pdf?src-supplier=element14; ComponentLink10Description: https://datasheet.octopart.com:443/RC0402FR-0722KL-Yageo-datasheet-8329306.pdf?src-supplier=element14; ComponentLink11URL: https://datasheet.octopart.com:443/RC0402FR-0722KL-Yageo-datasheet-8324527.pdf?src-supplier=Newark; ComponentLink11Description: https://datasheet.octopart.com:443/RC0402FR-0722KL-Yageo-datasheet-8324527.pdf?src-supplier=Newark; ComponentLink12URL: https://datasheet.octopart.com:443/RC0402FR-0722KL-Yageo-Group-datasheet-189192902.pdf?src-supplier=LCSC; ComponentLink12Description: https://datasheet.octopart.com:443/RC0402FR-0722KL-Yageo-Group-datasheet-189192902.pdf?src-supplier=LCSC; ComponentLink13URL: https://datasheet.octopart.com:443/RC0402FR-0722KL-Yageo-datasheet-175423674.pdf?src-supplier=SOS+electronic; ComponentLink13Description: https://datasheet.octopart.com:443/RC0402FR-0722KL-Yageo-datasheet-175423674.pdf?src-supplier=SOS+electronic; ComponentLink14URL: https://datasheet.octopart.com:443/RC0402FR-0722KL-Yageo-datasheet-148775077.pdf?src-supplier=TME; ComponentLink14Description: https://datasheet.octopart.com:443/RC0402FR-0722KL-Yageo-datasheet-148775077.pdf?src-supplier=TME; ComponentLink15URL: https://datasheet.octopart.com:443/RC0402FR-0722KL-Yageo-datasheet-79472498.pdf?src-supplier=Megastar; ComponentLink15Description: https://datasheet.octopart.com:443/RC0402FR-0722KL-Yageo-datasheet-79472498.pdf?src-supplier=Megastar; ComponentLink16URL: https://datasheet.octopart.com/RC0402FR-0722KL-Yageo-datasheet-73766026.pdf; ComponentLink16Description: https://datasheet.octopart.com/RC0402FR-0722KL-Yageo-datasheet-73766026.pdf; ComponentLink17URL: http://sigma.octopart.com:80/conflict_mineral_statement/Yageo-company-3.pdf?src-supplier=Compliance+Statements; ComponentLink17Description: http://sigma.octopart.com:80/conflict_mineral_statement/Yageo-company-3.pdf?src-supplier=Compliance+Statements; ComponentLink18URL: http://sigma.octopart.com:80/rohs_statement/Yageo-company-2.pdf?src-supplier=Compliance+Statements; ComponentLink18Description: http://sigma.octopart.com:80/rohs_statement/Yageo-company-2.pdf?src-supplier=Compliance+Statements; Supplier 2: LCSC; Supplier Part Number 2: C82868
U2 = SIC479ED-T1-GE3: Switching Voltage Regulators microBUCK 4.5-55V; 3A; Manufacturer: Vishay; Supplier 1: Mouser; Supplier Part Number 1: 78-SIC479ED-T1-GE3; Manufacturer Part Number: SIC479ED-T1-GE3; RoHS: Yes; Category: Voltage Regulators - Switching; Stock 1: 3358; Pricing 1: 1=4.1, 10=3.69, 50=3.41, 100=3.02, 1000=2.41, 10000=2.4 (USD); ComponentLink1URL: http://www.vishay.com/docs/77113/sic47x.pdf?src-supplier=Digi-Key; ComponentLink1Description: http://www.vishay.com/docs/77113/sic47x.pdf?src-supplier=Digi-Key; ComponentLink2URL: https://datasheet.octopart.com/SIC479ED-T1-GE3-Vishay-datasheet-156007660.pdf?src-supplier=Future+Electronics; ComponentLink2Description: https://datasheet.octopart.com/SIC479ED-T1-GE3-Vishay-datasheet-156007660.pdf?src-supplier=Future+Electronics; Supplier 2: Digi-Key; Supplier Part Number 2: 742-SIC479ED-T1-GE3CT-ND; Supplier 3: Newark; Supplier Part Number 3: 23AH3586; Supplier 4: Farnell; Supplier Part Number 4: 3212621
U3 = TLV61047DDCR: 20VIN, 28VOUT, 2.2A non-synchronous boost converter with SOT23-5 DDC package 5-SOT-23-THIN -40 to 125; Manufacturer: Texas Instruments; Manufacturer Lifecycle Status: ACTIVE; Supplier 1: Mouser; Supplier Part Number 1: 595-TLV61047DDCR; Manufacturer Part Number: TLV61047DDCR; RoHS: Compliant; Category: Voltage Regulators - Switching; Stock 1: 15925; Pricing 1: 1=1.53, 10=1.12, 50=1.02, 100=0.899, 1000=0.804, 10000=0.751 (USD); Height: 1.1mm; Length: 2.9mm; Lifecycle Status: Production; Pins: 5; Thickness: 870µm; Topology: Boost; Width: 1.6mm; ComponentLink1URL: https://sigma.octopart.com:443/182283154/technical_drawing/Texas-Instruments-TLV61047DDCR.pdf?src-supplier=Texas+Instruments; ComponentLink1Description: https://sigma.octopart.com:443/182283154/technical_drawing/Texas-Instruments-TLV61047DDCR.pdf?src-supplier=Texas+Instruments; ComponentLink2URL: https://octopart.com:443/opatz8j6/c1?t=0sDrM81eXzPZdi4iIMQFyfBLDqMQeFs1q5_Z0CIM6e8FtTQwGsV0i_5FKhhAX-USoIh9eJRCNgqqAxiBNUzRa-K58Ac_uREUTTPFGZv-8gAdGS-ZMeDerfDYqR8_jq5ecvkh78trHOm7yTNZvMvhjCvLAAXh6pPZrE44IE7iC-NKEeqIDYfGPzXo3mkFuFw6vAZi2nOUGRqpZrWy2BAt6khEcxFtMEuBKjxTAupNcD808xkyus-iNR4_MNuNV1zJpKR0BJ0XzRL6OxswCmkCXvrvgb6zVcHyAThwrSVfn-ozeuBYaJ0P-YpM29HQ-Qz8HFZr-gvl2nb6_CRzj05xkk8OhTGcLpx20NqrzwvqYFD3usc-elg3BDPQQTzL_oSlBNr70XQIIg&src-supplier=Texas+Instruments; ComponentLink2Description: https://octopart.com:443/opatz8j6/c1?t=0sDrM81eXzPZdi4iIMQFyfBLDqMQeFs1q5_Z0CIM6e8FtTQwGsV0i_5FKhhAX-USoIh9eJRCNgqqAxiBNUzRa-K58Ac_uREUTTPFGZv-8gAdGS-ZMeDerfDYqR8_jq5ecvkh78trHOm7yTNZvMvhjCvLAAXh6pPZrE44IE7iC-NKEeqIDYfGPzXo3mkFuFw6vAZi2nOUGRqpZrWy2BAt6khEcxFtMEuBKjxTAupNcD808xkyus-iNR4_MNuNV1zJpKR0BJ0XzRL6OxswCmkCXvrvgb6zVcHyAThwrSVfn-ozeuBYaJ0P-YpM29HQ-Qz8HFZr-gvl2nb6_CRzj05xkk8OhTGcLpx20NqrzwvqYFD3usc-elg3BDPQQTzL_oSlBNr70XQIIg&src-supplier=Texas+Instruments; ComponentLink3URL: http://sigma.octopart.com:80/reach_statement/Texas-Instruments-company-64.pdf?src-supplier=Compliance+Statements; ComponentLink3Description: http://sigma.octopart.com:80/reach_statement/Texas-Instruments-company-64.pdf?src-supplier=Compliance+Statements; ComponentLink4URL: http://sigma.octopart.com:80/conflict_mineral_statement/Texas-Instruments-company-63.pdf?src-supplier=Compliance+Statements; ComponentLink4Description: http://sigma.octopart.com:80/conflict_mineral_statement/Texas-Instruments-company-63.pdf?src-supplier=Compliance+Statements; Supplier 2: LCSC; Supplier Part Number 2: C44538408